# Altium schematic sheet RGB_Display.SchDoc
size A3; PageSetup: Record=PageOptions|CenterHorizontal=True|CenterVertical=True|PrintScale=0.73|XCorrection=1.00|YCorrection=1.00|PrintKind=0|BorderSize=5000000|LeftOffset=0|BottomOffset=0|Orientation=2|PaperLength=1000|PaperWidth=1000|Scale=100|PaperSource=7|PrintQuality=-4|MediaType=1|DitherType=10|PaperKind=A4|PrintScaleMode=1; Date: 27.05.2014; DrawnBy: luths8; Organization: BFH; Address1: Bern University of Applied Sciences; Address2: Engineering and Information Technology; Address3: Jlcoweg 1; Address4: CH-3400 Burgdorf; DocumentNumber: 9; Revision: 1.0; SheetNumber: 13; SheetTotal: 19; CurrentDate: 27.05.2014
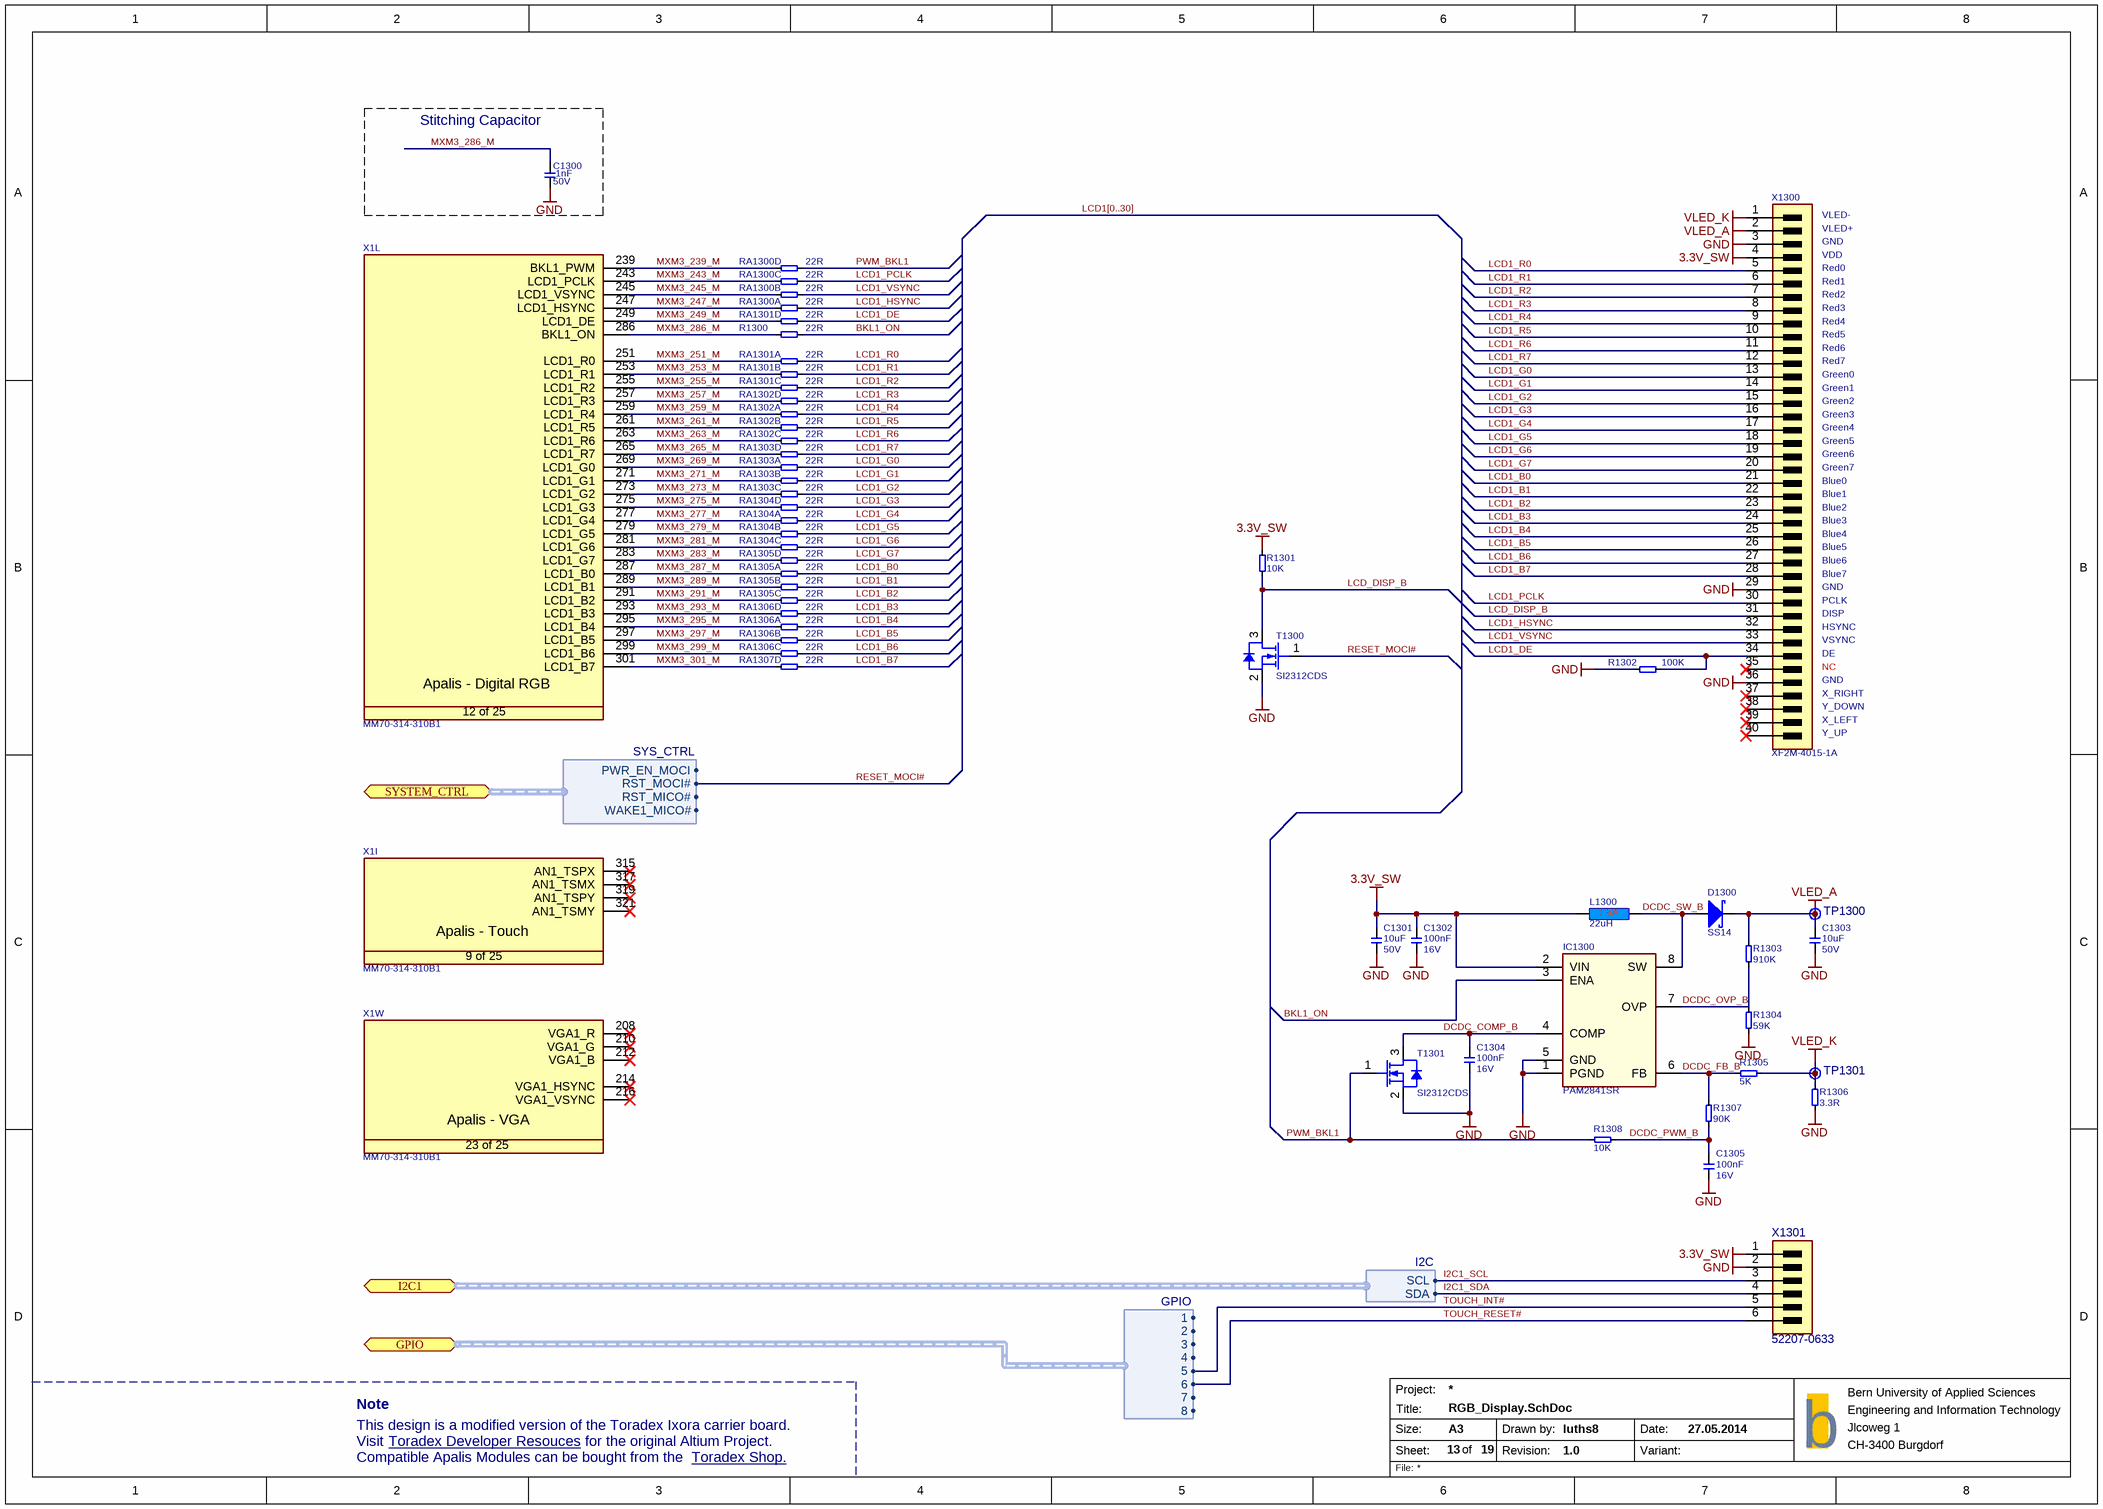
[diagram p0: RGB_Display.SchDoc]

## Parts
C1300  Rating: 50V  [SMD0603CAP]  (hidden comment: 1nF)
C1301  Rating: 50V  [SMD1210CAP]  (hidden comment: 10uF)
C1302  Rating: 16V  [SMD0603CAP]  (hidden comment: 100nF)
C1303  Rating: 50V  [SMD1210CAP]  (hidden comment: 10uF)
C1304  value 100nF  Rating: 16V  [SMD0603CAP]  (hidden comment: 100nF 16V)
C1305  value 100nF  Rating: 16V  [SMD0603CAP]  (hidden comment: 100nF 16V)
D1300  SS14  [T_DO-214-AC]
IC1300  PAM2841SR  [T_TSOP65P490X110-8N]
L1300  22uH  [T_INDM5050]
R1300  22R  [SMD0603RES]
R1301  10K  [SMD0603RES]
R1302  100K  [SMD0603RES]
R1303  910K  [SMD0603RES]
R1304  59K  [SMD0603RES]
R1305  5K  [SMD0603RES]
R1306  3.3R  [SMD0603RES]
R1307  90K  [SMD0603RES]
R1308  10K  [SMD0603RES]
RA1300  22R  [T_Resistor_Array_X4]  (parts A,B,C,D of 4)
RA1301  22R  [T_Resistor_Array_X4]  (parts A,B,C,D of 4)
RA1302  22R  [T_Resistor_Array_X4]  (parts A,B,C,D of 4)
RA1303  22R  [T_Resistor_Array_X4]  (parts A,B,C,D of 4)
RA1304  22R  [T_Resistor_Array_X4]  (parts A,B,C,D of 4)
RA1305  22R  [T_Resistor_Array_X4]  (parts A,B,C,D of 4)
RA1306  22R  [T_Resistor_Array_X4]  (parts A,B,C,D of 4)
RA1307  22R  [T_Resistor_Array_X4]  (part D of 4)
T1300  SI2312CDS  [T_SOT95P230X110-3N]
T1301  SI2312CDS  [T_SOT95P230X110-3N]
TP1300  Testpoint  [TP]  (value not drawn)  (no BOM)
TP1301  Testpoint  [TP]  (value not drawn)  (no BOM)
X1  Manufacturer Part No.: MM70-314-310B1  [T_JAE_MM70-314-310B1]  (hidden comment: CON-JAE-MM70-314-310B1-314-0.5mm)  (parts I,L,W of 25)
X1300  XF2M-4015-1A  [T_Omron_XF2M-4015-1A-MIRROR]
X1301  52207-0633  [T_MOLEX_52207-0633]

## Blocks framed on the sheet
Stitching Capacitor: C1300

## Ports
GPIO (bidir, harness GPIO, see 11, 19, 4), I2C1 (bidir, harness I2C, see 17, 18, 19, 5), SYSTEM_CTRL (bidir, harness SYS_CTRL, see 18, 19, 4)

## Harnesses
I2C: SCL, SDA
SYS_CTRL: PWR_EN_MOCI, RST_MOCI#, RST_MICO#, WAKE1_MICO#
GPIO: 1, 2, 3, 4, 5, 6, 7, 8

## Nets
3.3V_SW: C1301.2 C1302.1 IC1300.2(VIN) L1300.1 R1301.2 X1300.4(VCC) X1301.1
GND: C1300.1 C1301.1 C1302.2 C1303.1 C1304.1 C1305.1 IC1300.1(PGND) IC1300.5(GND) R1302.1 R1304.1 R1306.1 T1300.2(S) T1301.2(S) X1300.3(VCC) X1300.29(VSS) X1300.36(VDD) X1301.2
VLED_A: C1303.2 D1300.1 R1303.2 TP1300.1 X1300.2(VSS)
VLED_K: R1305.2 R1306.2 TP1301.1 X1300.1(VSS)
BKL1_ON: IC1300.3(ENA) R1300.2
DCDC_COMP_B: C1304.2 IC1300.4(COMP) T1301.3(D)
DCDC_FB_B: IC1300.6(FB) R1305.1 R1307.2
DCDC_OVP_B: IC1300.7(OVP) R1303.1 R1304.2
DCDC_PWM_B: C1305.2 R1307.1 R1308.2
DCDC_SW_B: D1300.2 IC1300.8(SW) L1300.2
I2C1_SCL: X1301.3 ; port I2C1.SCL
I2C1_SDA: X1301.4 ; port I2C1.SDA
LCD1_B0: RA1305.7 X1300.21(VSS)
LCD1_B1: RA1305.6 X1300.22(R5)
LCD1_B2: RA1305.5 X1300.23(R4)
LCD1_B3: RA1306.8 X1300.24(R3)
LCD1_B4: RA1306.7 X1300.25(R2)
LCD1_B5: RA1306.6 X1300.26(R1)
LCD1_B6: RA1306.5 X1300.27(R0)
LCD1_B7: RA1307.8 X1300.28(DCLK)
LCD1_DE: R1302.2 RA1301.8 X1300.34(SHUT)
LCD1_G0: RA1303.7 X1300.13(B0)
LCD1_G1: RA1303.6 X1300.14(VSS)
LCD1_G2: RA1303.5 X1300.15(G5)
LCD1_G3: RA1304.8 X1300.16(G4)
LCD1_G4: RA1304.7 X1300.17(G3)
LCD1_G5: RA1304.6 X1300.18(G2)
LCD1_G6: RA1304.5 X1300.19(G1)
LCD1_G7: RA1305.8 X1300.20(G0)
LCD1_HSYNC: RA1300.5 X1300.32(ENB)
LCD1_PCLK: RA1300.7 X1300.30(HSYNC)
LCD1_R0: RA1301.7 X1300.5(PWCTRL)
LCD1_R1: RA1301.6 X1300.6(LEDCTRL)
LCD1_R2: RA1301.5 X1300.7(RESET#)
LCD1_R3: RA1302.8 X1300.8(B5)
LCD1_R4: RA1302.7 X1300.9(B4)
LCD1_R5: RA1302.6 X1300.10(B3)
LCD1_R6: RA1302.5 X1300.11(B2)
LCD1_R7: RA1303.8 X1300.12(B1)
LCD1_VSYNC: RA1300.6 X1300.33(NC)
LCD_DISP_B: R1301.1 T1300.3(D) X1300.31(VSYNC)
MXM3_239_M: RA1300.4 X1.239(BKL1_PWM)
MXM3_243_M: RA1300.3 X1.243(LCD1_PCLK)
MXM3_245_M: RA1300.2 X1.245(LCD1_VSYNC)
MXM3_247_M: RA1300.1 X1.247(LCD1_HSYNC)
MXM3_249_M: RA1301.4 X1.249(LCD1_DE)
MXM3_251_M: RA1301.3 X1.251(LCD1_R0)
MXM3_253_M: RA1301.2 X1.253(LCD1_R1)
MXM3_255_M: RA1301.1 X1.255(LCD1_R2)
MXM3_257_M: RA1302.4 X1.257(LCD1_R3)
MXM3_259_M: RA1302.3 X1.259(LCD1_R4)
MXM3_261_M: RA1302.2 X1.261(LCD1_R5)
MXM3_263_M: RA1302.1 X1.263(LCD1_R6)
MXM3_265_M: RA1303.4 X1.265(LCD1_R7)
MXM3_269_M: RA1303.3 X1.269(LCD1_G0)
MXM3_271_M: RA1303.2 X1.271(LCD1_G1)
MXM3_273_M: RA1303.1 X1.273(LCD1_G2)
MXM3_275_M: RA1304.4 X1.275(LCD1_G3)
MXM3_277_M: RA1304.3 X1.277(LCD1_G4)
MXM3_279_M: RA1304.2 X1.279(LCD1_G5)
MXM3_281_M: RA1304.1 X1.281(LCD1_G6)
MXM3_283_M: RA1305.4 X1.283(LCD1_G7)
MXM3_286_M: C1300.2 R1300.1 X1.286(BKL1_ON)
MXM3_287_M: RA1305.3 X1.287(LCD1_B0)
MXM3_289_M: RA1305.2 X1.289(LCD1_B1)
MXM3_291_M: RA1305.1 X1.291(LCD1_B2)
MXM3_293_M: RA1306.4 X1.293(LCD1_B3)
MXM3_295_M: RA1306.3 X1.295(LCD1_B4)
MXM3_297_M: RA1306.2 X1.297(LCD1_B5)
MXM3_299_M: RA1306.1 X1.299(LCD1_B6)
MXM3_301_M: RA1307.4 X1.301(LCD1_B7)
PWM_BKL1: R1308.1 RA1300.8 T1301.1(G)
RESET_MOCI#: T1300.1(G) ; port SYSTEM_CTRL.RST_MOCI#
TOUCH_INT#: X1301.5 ; port GPIO.5
TOUCH_RESET#: X1301.6 ; port GPIO.6

Not connected (* = marked no-connect by the designer): X1 208(VGA1_R)* 210(VGA1_G)* 212(VGA1_B)* 214(VGA1_HSYNC)* 216(VGA1_VSYNC)* 315(AN1_TSPX)* 317(AN1_TSMX)* 319(AN1_TSPY)* 321(AN1_TSMY)*; X1300 35(VSS)* 37(YU)* 38(XR)* 39(YD)* 40(XL)*

## Buses and harness runs
bus LCD1[0..30]

## Notes on the sheet
- (near X1300) VLED-
- (near X1300) VLED+
- (near X1300) GND
- (near X1300) Red0
- (near X1300) Red1
- (near X1300) Red2
- (near X1300) Red3
- (near X1300) VDD
- (near X1300) Green0
- (near X1300) Red4
- (near X1300) Red5
- (near X1300) Red6
- (near X1300) Red7
- (near X1300) Green1
- (near X1300) Green2
- (near X1300) Green3
- (near X1300) Green4
- (near X1300) Green5
- (near X1300) Blue0
- (near X1300) Blue1
- (near X1300) Blue2
- (near X1300) Green6
- (near X1300) Green7
- (near X1300) Blue3
- (near X1300) Blue4
- (near X1300) Blue5
- (near X1300) Blue6
- (near X1300) Blue7
- (near X1300) PCLK
- (near X1300) DISP
- (near X1300) HSYNC
- (near X1300) VSYNC
- (near X1300) DE
- (near X1300) NC
- (near X1300) X_RIGHT
- (near X1300) Y_DOWN
- (near X1300) X_LEFT
- (near X1300) Y_UP
- Note
- This design is a modified version of the Toradex Ixora carrier board.
- Visit
- Compatible Apalis Modules can be bought from the
- Toradex Developer Resouces <https://developer.toradex.com/products/ixora-carrier-board>
- for the original Altium Project.
- Toradex Shop. <https://www.toradex.com/order-now/apalis-arm-family>
- Project:
- Size:
- Sheet:
- Title:
- A3
- of
- Drawn by:
- Revision:
- Date:
- Variant:
- b
- File:
- (in symbol CON-JAE-MM70-314-310B1-314-0.5mm, part I) Apalis - Touch; 9 of 25
- (in symbol CON-JAE-MM70-314-310B1-314-0.5mm, part L) Apalis - Digital RGB; 12 of 25
- (in symbol CON-JAE-MM70-314-310B1-314-0.5mm, part W) Apalis - VGA; 23 of 25

## Library data of the parts
C1300 = C-X7R-1nF-50V-10%-0402: Capacitor Ceramic X7R 1nF 50V 10% 0603; Tolerance: 10%; Type: X7R; Value: 1nF
C1301 C1303 = C-X5R-10uF-50V-10%-1210: Capacitor Ceramic X5R 10uF 50V 10% 1210; Manufacturer: Generic; Tolerance: 10%; Type: X5R; Manufacturer Part Number: *; Value: 10uF
C1302 = C-X7R-100nF-16V-10%-0603: Capacitor Ceramic X7R 100nF 16V 10% 0603; Manufacturer: Generic; Tolerance: 10%; Type: X7R; Manufacturer Part Number: *; Value: 100nF
C1304 C1305 = C-X7R-100nF-16V-10%-0603: Capacitor Ceramic X7R 100nF 16V 10% 0603; Tolerance: 10%; Type: X7R
D1300 = D-Fairchild-SS14: Schottky Diode 40V 1A; Manufacturer Name: Fairdhild; Manufacturer Part No.: SS14
IC1300 = IC-DiodesInc-PAM2841GR: Diodes Inc, PAM2841GR, DC/DC step-up LED driver; Manufacturer: Diodes Incorporated; Manufacturer Part No.: PAM2841GR; Package: DFN2x2-8
L1300 = L-Bourns-SRN5040-220M: Inductor shielded 22uH 1.6A; Manufacturer: Generic; Tolerance: 25%; Rating: 1.6A; Manufacturer Part Number: *; Value: 22uH
R1300 = R-22R-63mW-5%-0402: Resistor 22 ohm 63mW 5% 0603; Rating: 63mW; Tolerance: 5%; Value: 22R
R1301 R1308 = R-10KR-63mW-1%-0603: Resistor 10 Kohm 63mW 1% 0603; Manufacturer: Generic; Rating: 63mW; Tolerance: 1%; Value: 10K; Manufacturer Part Number: *
R1302 = R-100KR-63mW-5%-0603: Resistor 100 Kohm 63mW 5% 0603; Manufacturer: Generic; Value: 100KR; Rating: 63mW; Tolerance: 5%; Manufacturer Part Number: *
R1303 = R-910KR-63mW-1%-0603: Resistor 910 Kohm 63mW 1% 0603; Manufacturer: Generic; Value: 910KR; Rating: 63mW; Tolerance: 1%; Manufacturer Part Number: *
R1304 = R-59KR-63mW-1%-0603: Resistor 59 Kohm 63mW 1% 0603; Manufacturer: Generic; Value: 49KR; Rating: 63mW; Tolerance: 1%; Manufacturer Part Number: *
R1305 = R-5KR-63mW-1%-0603: Resistor 5 Kohm 63mW 1% 0603; Manufacturer: Generic; Rating: 63mW; Tolerance: 1%; Value: 5K; Manufacturer Part Number: *
R1306 = R-3.3R-63mW-1%-0603: Resistor 3.3 ohm 63mW 1% 0603; Manufacturer: Generic; Rating: 63mW; Tolerance: 1%; Manufacturer Part Number: *; Value: 3.3R
R1307 = R-90KR-63mW-1%-0603: Resistor 90 Kohm 63mW 1% 0603; Manufacturer: Generic; Rating: 63mW; Tolerance: 1%; Value: 90K; Manufacturer Part Number: *
RA1300-RA1307 = RA-22R-63mW-5%-1206-div: Resistor Array 22 R 63mW 5% 1206; Tolerance: 5%; Power Dissipation: 63mW; Value: 22R
T1300 T1301 = T-Vishay-SI2312CDS: N-Channel 20V (D-S)  MOSFET; Manufacturer: Vishay; Manufacturer Part No.: SI2312CDS
X1 = CON-JAE-MM70-314-310B1-314-0.5mm: MXM3 Connector; Manufacturer Name: JAE; No. of ways: 314
X1300 = CON-Omron-XF2M-4015-1A-40-0.5mm: RGB Connector; Manufacturer Name: Omron; No. of ways: 40; Pitch: 0.5mm; Manufacturer Part No.: XF2M-4015-1A; System: Connector
X1301 = CON-Molex-52207-0633: 1mm Pitch FFC/FPC Connector; Manufacturer Name: Molex; No. of ways: 8; Pitch: 0.5mm; Manufacturer Part No.: 52207-0633; System: Connector